# EAGLE design PCB_Acquisition_board.v1.4.3 (EAGLE 9.6.2)
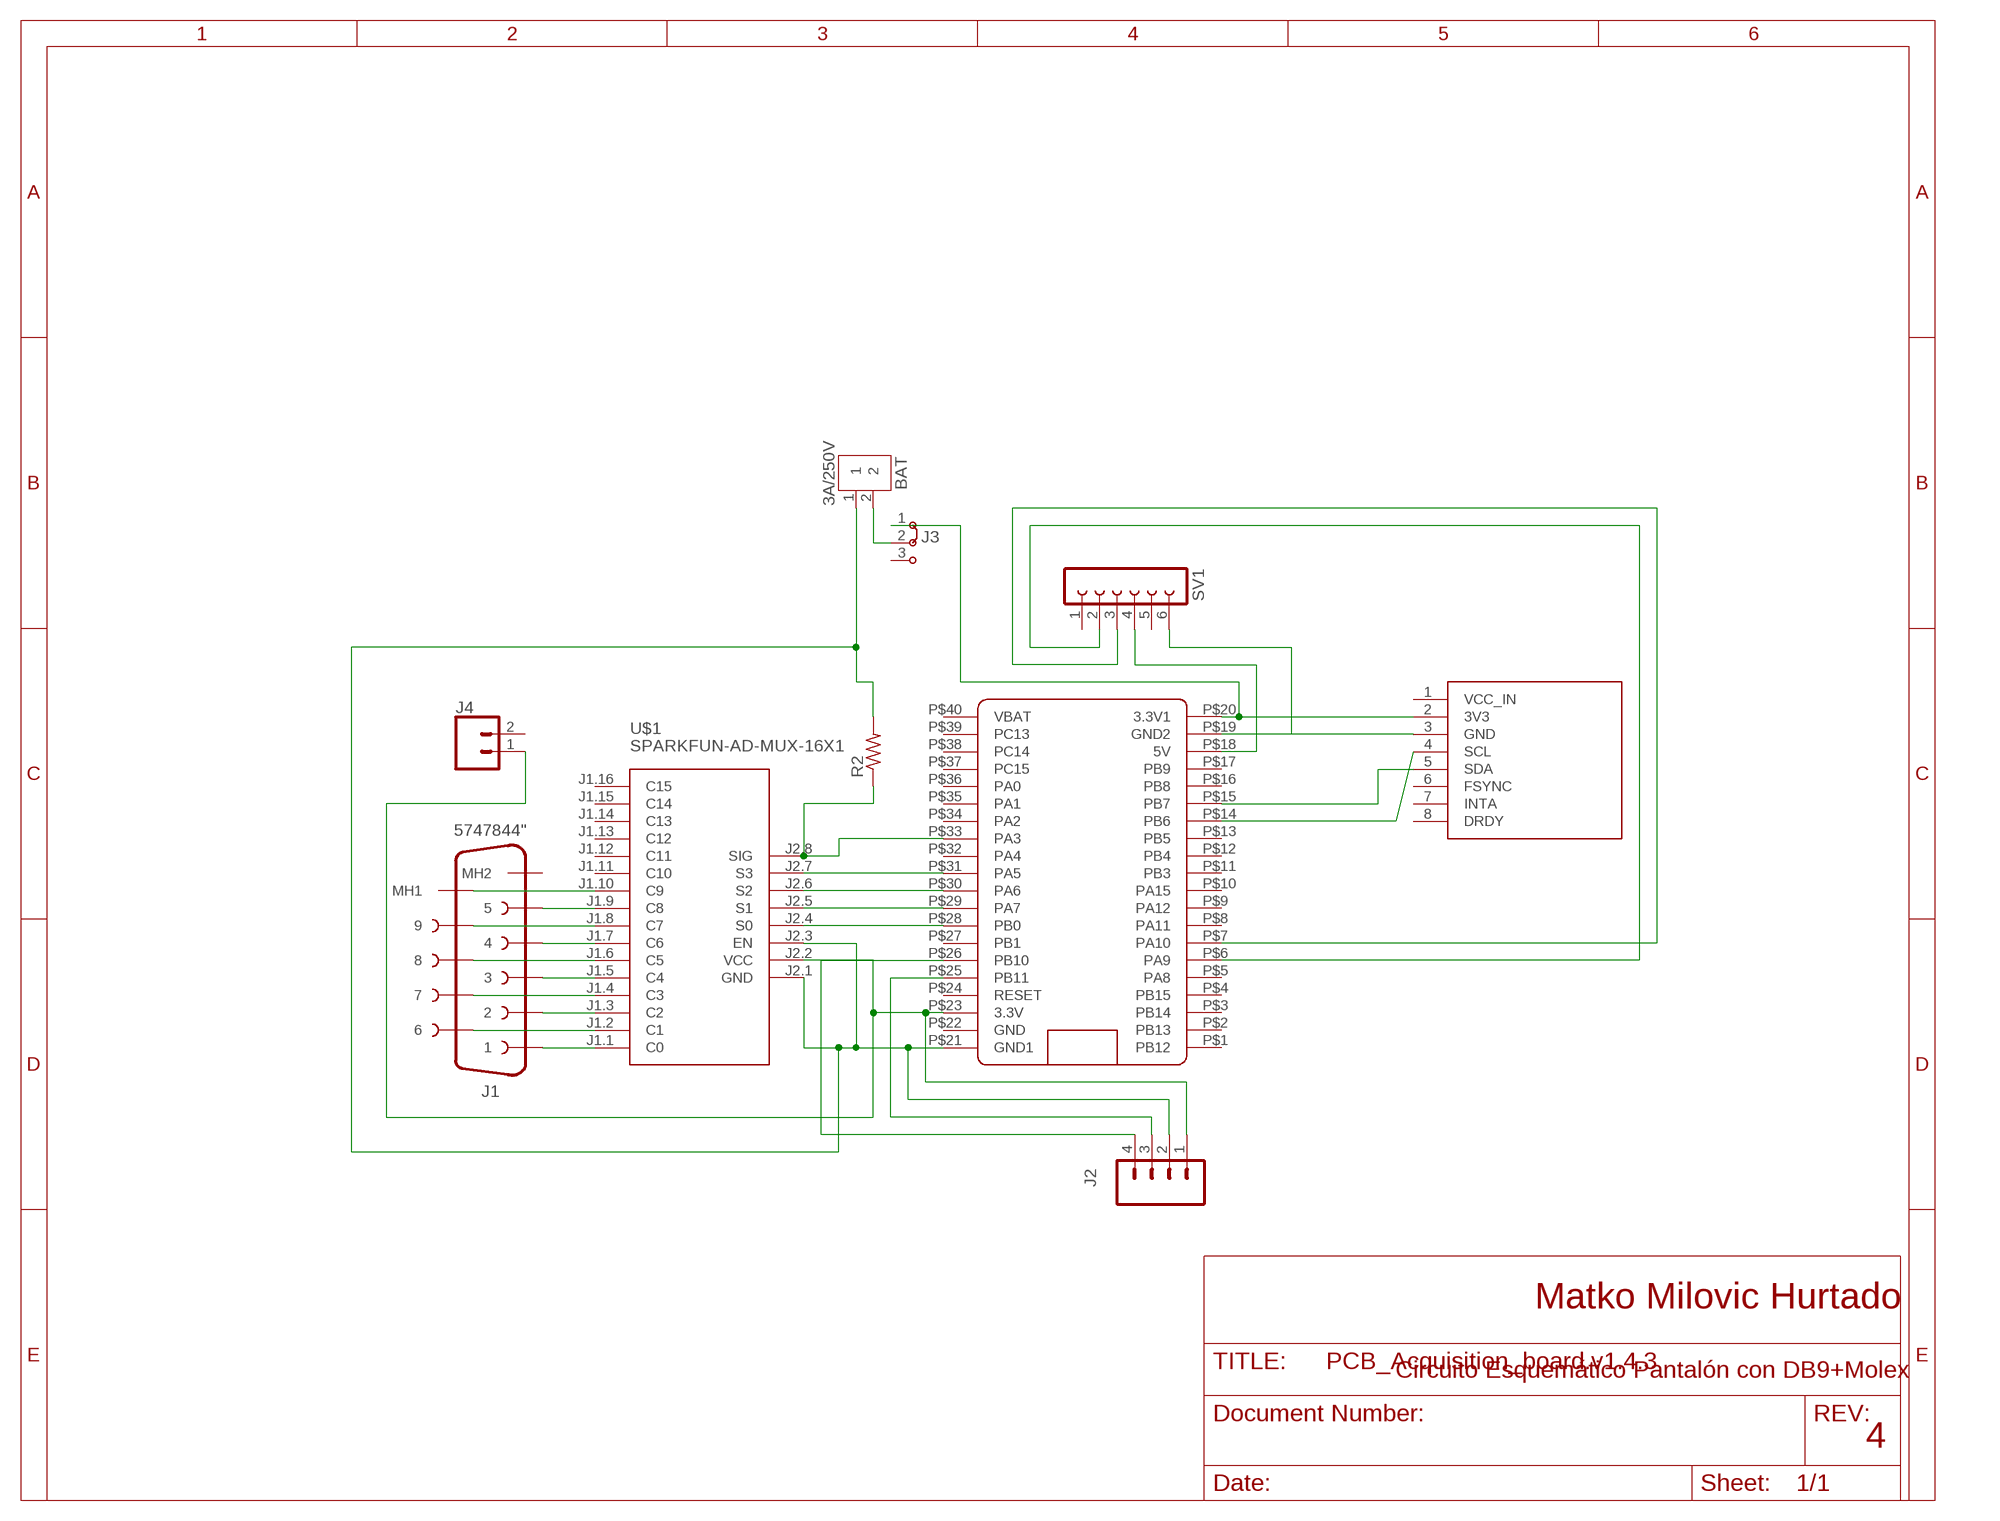
[diagram p0: schematic, sheet 1]

## Parts
BAT  3A/250V  B2B-XH-A  [B2B-XH-A]
J1  5747844"  [5747844-4]
J2  CONN_04  [1X04]
J3  J2X2MM  [04C]
J4  CONN_02  [1X02]
R2  R-US_0309/10  [0309/10]
SV1  FE06-1  [FE06]
U$1  SPARKFUN-AD-MUX-16X1  [SPARKFUN-AD-MUX-16X1]
U$2  GY-86  [GY-86]
U$5  BLUE_PILL  [BLUE_PILL]

## Nets
MH1: J1.MH2(MH1) U$1.J1.10(C9)
N$1: BAT.2 J3.2
N$2: U$2.4(SCL) U$5.P$14(PB6)
N$3: J1.1 U$1.J1.1(C0)
N$4: J1.6 U$1.J1.2(C1)
N$5: J1.2 U$1.J1.3(C2)
N$6: J1.7 U$1.J1.4(C3)
N$7: J1.3 U$1.J1.5(C4)
N$8: J1.8 U$1.J1.6(C5)
N$10: J1.4 U$1.J1.7(C6)
N$11: J1.9 U$1.J1.8(C7)
N$13: J2.3 U$5.P$25(PB11)
N$14: U$1.J2.4(S0) U$5.P$28(PB0)
N$15: J1.5 U$1.J1.9(C8)
N$16: J2.1 J4.1 U$1.J2.2(VCC) U$5.P$23(3.3V)
N$17: BAT.1 J2.2 R2.2 U$1.J2.1(GND) U$1.J2.3(EN) U$5.P$21(GND1)
N$18: J2.4 U$5.P$26(PB10)
N$19: U$2.5(SDA) U$5.P$15(PB7)
N$20: SV1.3 U$5.P$7(PA10)
N$21: SV1.2 U$5.P$6(PA9)
N$25: U$1.J2.5(S1) U$5.P$29(PA7)
N$26: U$1.J2.6(S2) U$5.P$30(PA6)
N$27: U$1.J2.7(S3) U$5.P$31(PA5)
N$28: R2.1 U$1.J2.8(SIG) U$5.P$33(PA3)
N$30: SV1.6 U$2.3(GND) U$5.P$19(GND2)
N$31: J3.1 U$2.2(3V3) U$5.P$20(3.3V1)
N$35: SV1.4 U$5.P$18(5V)
Unconnected: J1.MH1(MH2) J3.3 J4.2 SV1.1 SV1.5 U$1.J1.11(C10) U$1.J1.12(C11) U$1.J1.13(C12) U$1.J1.14(C13) U$1.J1.15(C14) U$1.J1.16(C15) U$2.1(VCC_IN) U$2.6(FSYNC) U$2.7(INTA) U$2.8(DRDY) U$5.P$1(PB12) U$5.P$2(PB13) U$5.P$3(PB14) U$5.P$4(PB15) U$5.P$5(PA8) U$5.P$8(PA11) U$5.P$9(PA12) U$5.P$10(PA15) U$5.P$11(PB3) U$5.P$12(PB4) U$5.P$13(PB5) U$5.P$16(PB8) U$5.P$17(PB9) U$5.P$22(GND) U$5.P$24(RESET) U$5.P$27(PB1) U$5.P$32(PA4) U$5.P$34(PA2) U$5.P$35(PA1) U$5.P$36(PA0) U$5.P$37(PC15) U$5.P$38(PC14) U$5.P$39(PC13) U$5.P$40(VBAT)

## Notes on the sheet
- Matko Milovic Hurtado
- Circuito Esquemático Pantalón con DB9+Molex
- 4

## Library data of the parts
BAT = Connector:B2B-XH-A: XH Connector Top Entry - 2POS Details see: Datasheet <http://www.jst-mfg.com/product/pdf/eng/eXH.pdf>; CATEGORY: CONNECTOR; DESCRIPTION: 2.5mm pitch/disconnectable crimp style connector; MANUFACTURER: JST (XH CONNECTOR); MPN: B2B-XH-A; OPERATING_TEMPERATURE: -25°C ~ 85°C; PART_STATUS: ACTIVE; ROHS_COMPLIANT: COMPLIANT; SERIES: B_B-XH-A; SUB_CATEGORY: Through hole connector; TYPE: top entry
J1 = Connector_D-Sub:5747844: D-SUB, 9POS, RCPT, R/A SLDR Datasheet <https://www.te.com/commerce/DocumentDelivery/DDEController?Action=showdoc&DocId=Catalog+Section%7F82068_AMPLIMITE_Right-Angle_Posted_Conn%7F0412%7Fpdf%7FEnglish%7FENG_CS_82068_AMPLIMITE_Right-Angle_Posted_Conn_0412.pdf%7F5747840-4>; CATEGORY: Connector; DESCRIPTION: PCB D-Sub Connectors, Receptacle, Board-to-Board, 9 Position, 2.74mm [.108in] Centerline, 2 Row, Row-to-Row Spacing 2.84 mm [. 112 in]; GENDER: Female; MANUFACTURER: TE Connectivity; MPN: 5747844-4; OPERATING_TEMP: -55°C to +105 °C; PART_STATUS: Active; ROHS_COMPLIANT: RoHS Compliant; SERIES: AMPLIMITE HD-20; SUB-CATEGORY: D-SUB; TYPE: R/A
J2 = SparkFun-Connectors:CONN_04: Multi connection point. Often used as Generic Header-pin footprint for 0.1 inch spaced/style header connections On any of the 0.1 inch spaced packages, you can populate with these: Break Away Headers - Straight <https://www.sparkfun.com/products/116> (PRT-00116) Break Away Male Headers - Right Angle <https://www.sparkfun.com/products/553> (PRT-00553) Female Headers <https://www.sparkfun.com/products/115> (PRT-00115) Break Away Headers - Machine Pin <https://www.sparkfun.com/products/117> (PRT-00117) Break Away Female Headers - Swiss Machine Pin <https://www.sparkfun.com/products/743> (PRT-00743) For SCREWTERMINALS and SPRING TERMINALS visit here: Screw Terimnals on SparkFun.com <https://www.sparkfun.com/search/results?term=Screw+Terminals> (5mm/3.5mm/2.54mm spacing) This device is also useful as a general connection point to wire up your design to another part of your project. Our various solder wires solder well into these plated through hole pads. Hook-Up Wire - Assortment (Stranded, 22 AWG) <https://www.sparkfun.com/products/11375> (PRT-11375) Hook-Up Wire - Assortment (Solid Core, 22 AWG) <https://www.sparkfun.com/products/11367> (PRT-11367) View the entire wire category on our website here <https://www.sparkfun.com/categories/141> Special notes: Molex polarized connector foot print use with SKU : PRT-08231 with associated crimp pins and housings. 1MM SMD Version SKU: PRT-10208; PROD_ID: CONN-09696
J3 = jumper:J2: Jumper switch 2 x 2.5 mm
J4 = SparkFun-Connectors:CONN_02: Multi connection point. Often used as Generic Header-pin footprint for 0.1 inch spaced/style header connections On any of the 0.1 inch spaced packages, you can populate with these: Break Away Headers - Straight <https://www.sparkfun.com/products/116> (PRT-00116) Break Away Male Headers - Right Angle <https://www.sparkfun.com/products/553> (PRT-00553) Female Headers <https://www.sparkfun.com/products/115> (PRT-00115) Break Away Headers - Machine Pin <https://www.sparkfun.com/products/117> (PRT-00117) Break Away Female Headers - Swiss Machine Pin <https://www.sparkfun.com/products/743> (PRT-00743) For SCREWTERMINALS and SPRING TERMINALS visit here: Screw Terimnals on SparkFun.com <https://www.sparkfun.com/search/results?term=Screw+Terminals> (5mm/3.5mm/2.54mm spacing) This device is also useful as a general connection point to wire up your design to another part of your project. Our various solder wires solder well into these plated through hole pads. Hook-Up Wire - Assortment (Stranded, 22 AWG) <https://www.sparkfun.com/products/11375> (PRT-11375) Hook-Up Wire - Assortment (Solid Core, 22 AWG) <https://www.sparkfun.com/products/11367> (PRT-11367) View the entire wire category on our website here <https://www.sparkfun.com/categories/141> Special notes: Molex polarized connector foot print use with: PRT-08233 with associated crimp pins and housings. 2.54_SCREWTERM for use with PRT-10571. 3.5mm Screw Terminal footprints for PRT-08084 5mm Screw Terminal footprints for use with PRT-08432
R2 = rcl:R-US_: RESISTOR, American symbol; SPICEPREFIX: R
SV1 = con-lsta:FE06-1: FEMALE HEADER; OC_FARNELL: unknown; OC_NEWARK: unknown
U$1 = diy-modules:SPARKFUN-AD-MUX-16X1: SparkFun Analog/Digital MUX Breakout based on CD74HC4067 chip Source: https://www.sparkfun.com/products/9056
U$2 = GY_Boards:GY-86
U$5 = BluePill:BLUE_PILL

## Module MUX16CH
Ports: 

### Library data of the parts

## Board
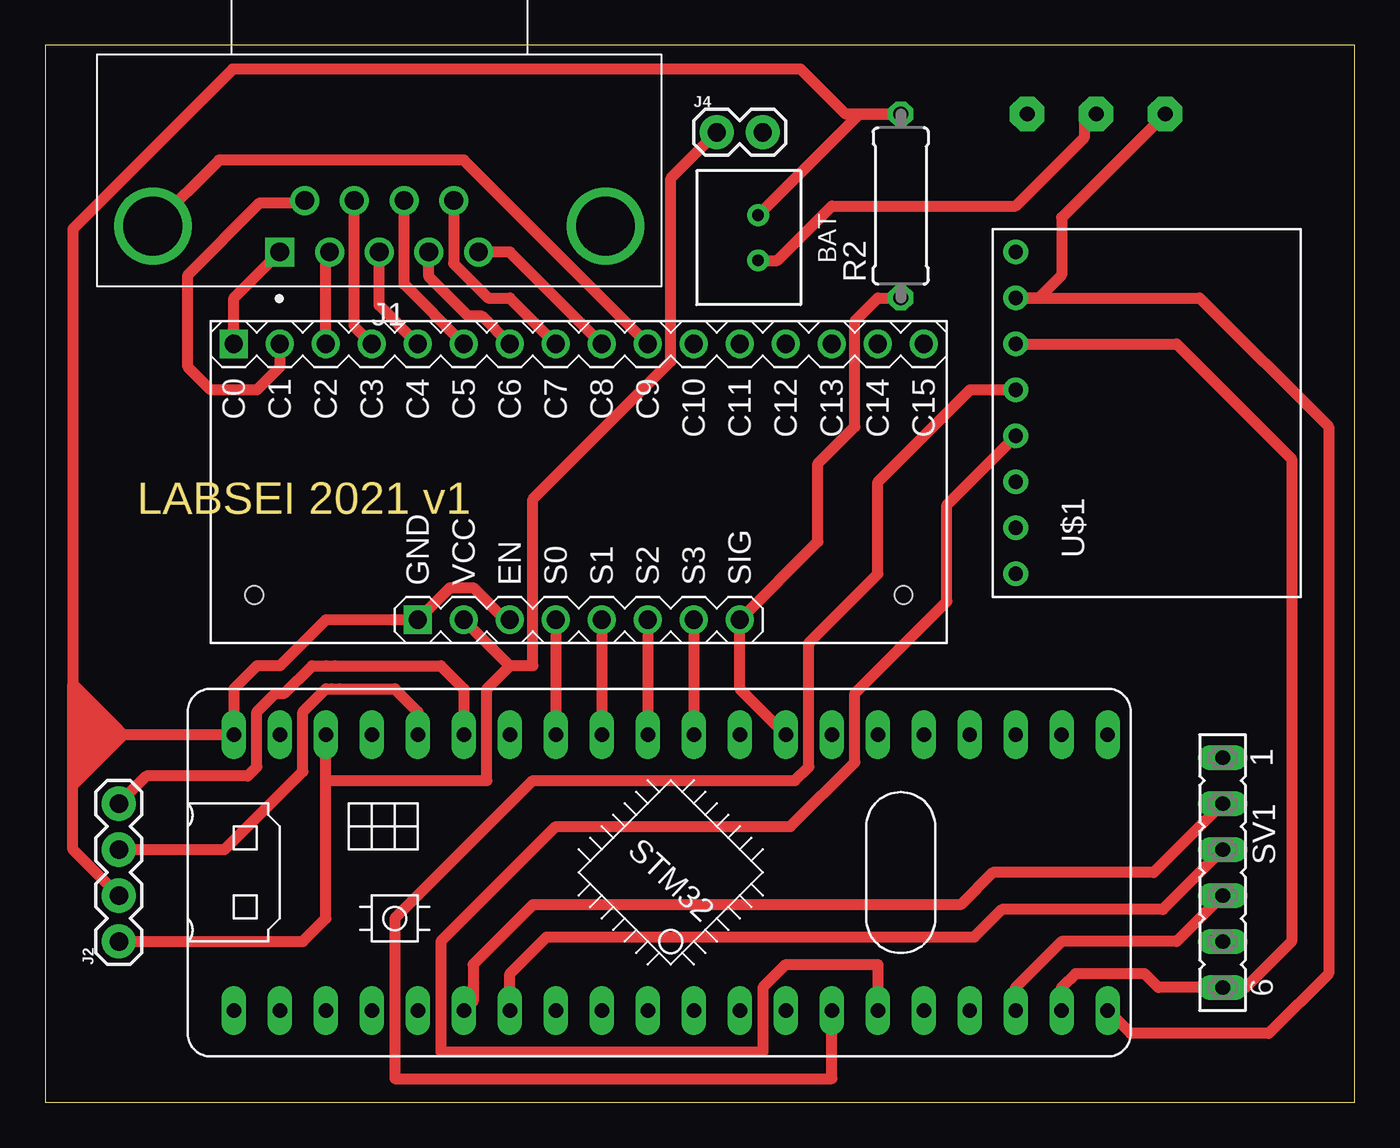
[diagram p1: board, top side]
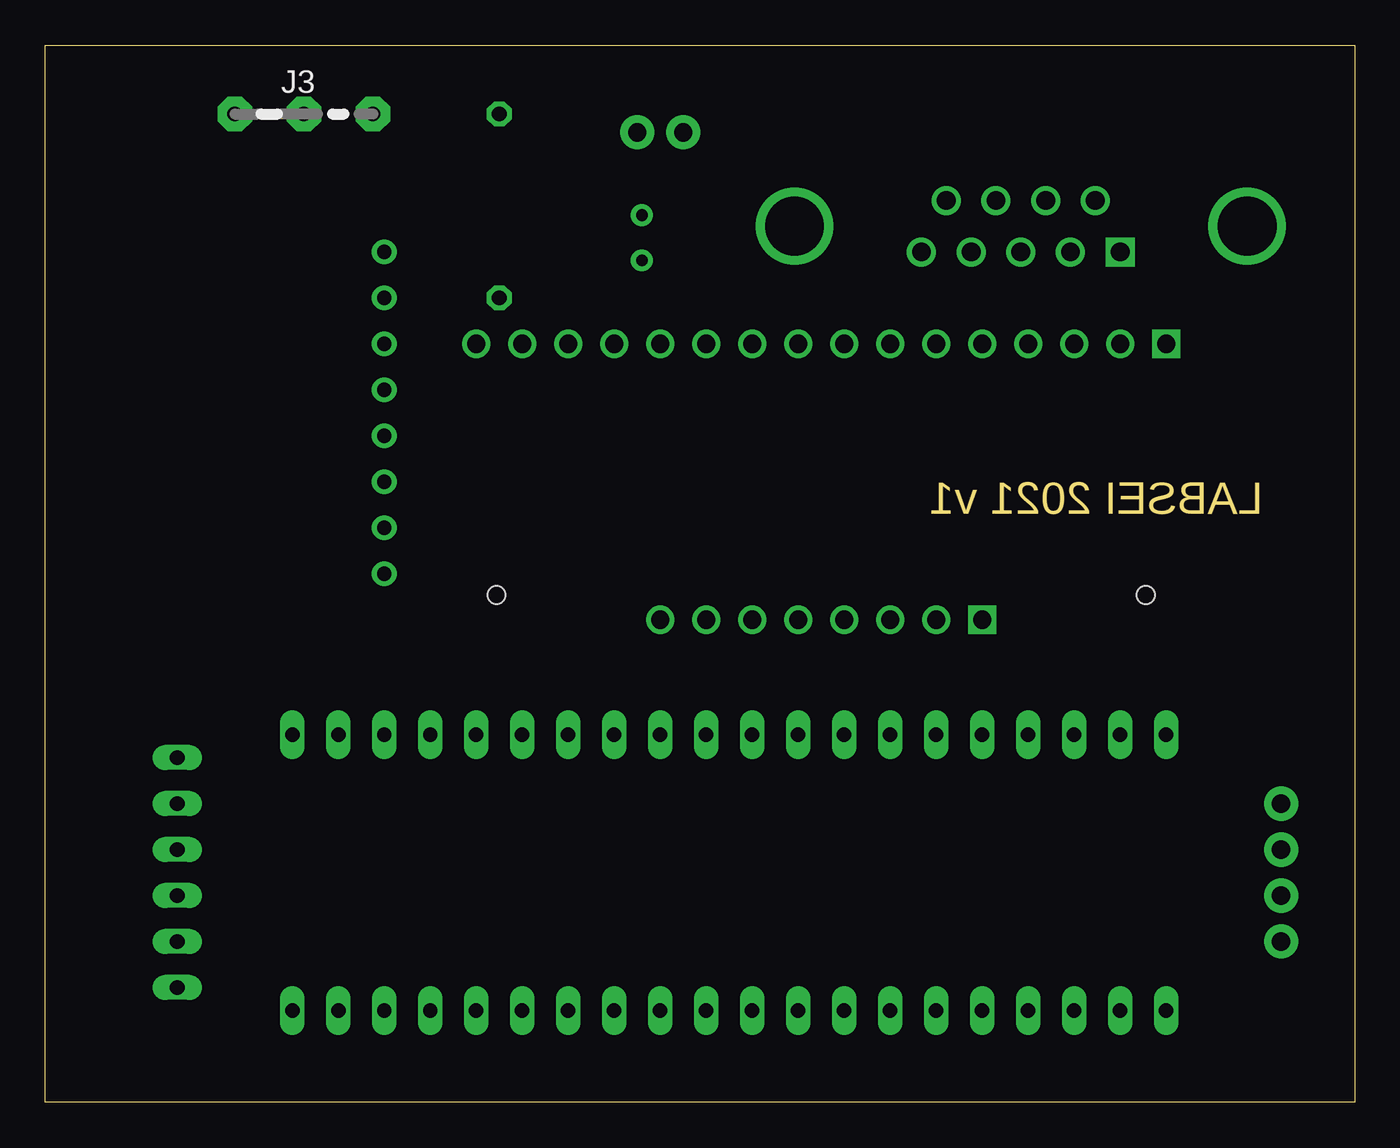
[diagram p2: board, bottom side, seen from below]

Size 72.31 x 58.41 mm. Coordinates in mm from the lower left corner, seen from the top.
Outline: 0,0 72.31,0 72.31,58.41 0,58.41 0,0
Copper layers (1*16): Top 0.035mm / dielectric 1.5mm / Bottom 0.035mm
Design rules "default *": minimum track width 6mil, minimum drill 0.35mm, track to track 6mil, track to pad 6mil, pad to pad 6mil, via to via 6mil, smd to smd 6mil, copper to edge 40mil, drill to drill 6mil, minimum pad ring 11mil, minimum via ring 10mil, stop-mask expansion 4mil, vias tented up to drill 0mil, thermal gap 10mil

### Footprints (pad centres in the part's own frame; a part is rotated, then mirrored left to right if it is on the bottom)
B2B-XH-A = drill 0.64: 1 0,0; 2 2.5,0
5747844-4 = drill 1.041 square: 1 0,0 | drill 1.041: 2 -2.743,0; 3 -5.486,0; 4 -8.23,0; 5 -10.973,0; 6 -1.372,-2.845; 7 -4.115,-2.845; 8 -6.858,-2.845; 9 -9.601,-2.845 | drill 3.251: MH1 -17.983,-1.422; MH2 7.01,-1.422
1X04 = drill 1.016 pad 1.88: 1 0,0; 2 2.54,0; 3 5.08,0; 4 7.62,0
04C = drill 0.813 pad 1.905 octagon: 1 -1.905,0; 2 1.905,0; 3 5.715,0
1X02 = drill 1.016 pad 1.88: 1 0,0; 2 2.54,0
0309/10 = drill 0.813 octagon: 1 -5.08,0; 2 5.08,0
FE06 = drill 0.813 long: 1 -6.35,0; 2 -3.81,0; 3 -1.27,0; 4 1.27,0; 5 3.81,0; 6 6.35,0
SPARKFUN-AD-MUX-16X1 = drill 1 square: J1.1 -7.62,-19.05; J2.1 7.62,-8.89 | drill 1: J1.2 -7.62,-16.51; J1.3 -7.62,-13.97; J1.4 -7.62,-11.43; J1.5 -7.62,-8.89; J1.6 -7.62,-6.35; J1.7 -7.62,-3.81; J1.8 -7.62,-1.27; J1.9 -7.62,1.27; J1.10 -7.62,3.81; J1.11 -7.62,6.35; J1.12 -7.62,8.89; J1.13 -7.62,11.43; J1.14 -7.62,13.97; J1.15 -7.62,16.51; J1.16 -7.62,19.05; J2.2 7.62,-6.35; J2.3 7.62,-3.81; J2.4 7.62,-1.27; J2.5 7.62,1.27; J2.6 7.62,3.81; J2.7 7.62,6.35; J2.8 7.62,8.89 | hole 1: 6.245,-17.93; 6.245,17.93
GY-86 = drill 0.8: 1 1.27,19.05; 2 1.27,16.51; 3 1.27,13.97; 4 1.27,11.43; 5 1.27,8.89; 6 1.27,6.35; 7 1.27,3.81; 8 1.27,1.27
BLUE_PILL = drill 0.8 long: P$1 -7.62,15.24; P$2 -7.62,12.7; P$3 -7.62,10.16; P$4 -7.62,7.62; P$5 -7.62,5.08; P$6 -7.62,2.54; P$7 -7.62,0; P$8 -7.62,-2.54; P$9 -7.62,-5.08; P$10 -7.62,-7.62; P$11 -7.62,-10.16; P$12 -7.62,-12.7; P$13 -7.62,-15.24; P$14 -7.62,-17.78; P$15 -7.62,-20.32; P$16 -7.62,-22.86; P$17 -7.62,-25.4; P$18 -7.62,-27.94; P$19 -7.62,-30.48; P$20 -7.62,-33.02; P$21 7.62,15.24; P$22 7.62,12.7; P$23 7.62,10.16; P$24 7.62,7.62; P$25 7.62,5.08; P$26 7.62,2.54; P$27 7.62,0; P$28 7.62,-2.54; P$29 7.62,-5.08; P$30 7.62,-7.62; P$31 7.62,-10.16; P$32 7.62,-12.7; P$33 7.62,-15.24; P$34 7.62,-17.78; P$35 7.62,-20.32; P$36 7.62,-22.86; P$37 7.62,-25.4; P$38 7.62,-27.94; P$39 7.62,-30.48; P$40 7.62,-33.02

### Placement (x,y rotation side)
BAT  39.37,49.02 270 top
J1  12.95,46.99 180 top
J2  4.06,8.89 90 top
J3  59.94,54.61 0 bottom
J4  37.08,53.59 0 top
R2  47.24,49.53 90 top
SV1  65.02,12.7 270 top
U$1  29.46,34.29 270 top
U$2  52.32,27.94 0 top
U$5  25.65,12.7 90 top

### Tracks (layer width: path | path; a pad name or v marks a point on that pad's centre or on a via)
MH1
  Top 0.61: U$1.J1.10 23.11,52.07 9.6,52.07 J1.MH2
N$1
  Top 0.61: BAT.2 40.43,46.52 43.43,49.53 53.59,49.53 57.4,53.34 57.4,54.61 J3.2
N$2
  Top 0.61: U$2.4 51.05,39.37 45.97,34.29 45.97,29.2 42.16,25.39 42.16,18.54 41.4,17.78 26.92,17.78 19.3,10.16 19.3,1.32 43.43,1.32 U$5.P$14
N$3
  Top 0.61: U$1.J1.1 10.41,44.45 J1.1
N$4
  Top 0.61: J1.6 14.19,49.7 11.86,49.7 7.87,45.72 7.87,40.64 9.14,39.37 11.68,39.37 12.95,40.64 U$1.J1.2
N$5
  Top 0.61: U$1.J1.3 15.49,46.79 J1.2
N$6
  Top 0.61: 17.2,49.7 J1.7 17.07,42.88 U$1.J1.4
N$7
  Top 0.61: U$1.J1.5 18.44,44.04 J1.3
N$8
  Top 0.61: U$1.J1.6 19.81,45.21 J1.8
N$9  (via drill 0.35)
  other vias: 5.84,48.51
N$10
  Top 0.61: J1.4 21.18,45.62 23.37,43.43 24.13,43.43 U$1.J1.7
N$11
  Top 0.61: J1.9 22.55,46.36 24.46,44.45 25.65,44.45 U$1.J1.8
N$12  (via drill 0.35)
  other vias: 30.99,48.51
N$13
  Top 0.61: U$5.P$25 20.57,21.59 19.3,22.86 16.26,22.86 15.81,22.86 15.49,22.86 14.22,21.59 14.22,18.29 9.91,13.97 J2.3
N$14
  Top 0.61: U$1.J2.4 U$5.P$28
N$15
  Top 0.61: U$1.J1.9 25.65,46.99 J1.5
N$16
  Top 0.61: J2.1 14.22,8.89 15.49,10.16 15.49,17.78 | 15.49,17.78 U$5.P$23 | 25.65,24.13 26.92,24.13 26.92,33.34 34.54,40.96 34.54,51.05 J4.1 | 25.65,24.13 U$1.J2.2 | 15.49,17.78 24.38,17.78 24.38,22.86 25.65,24.13
N$17
  Top 0.508: 2.03,22.1 2.54,22.1
  Top 0.61: BAT.1 44.96,54.61 R2.2 44.2,54.61 41.72,57.09 10.35,57.09 1.52,48.26 1.52,23.11 | 4.32,20.32 U$5.P$21 10.41,22.86 11.68,24.13 12.95,24.13 15.49,26.67 U$1.J2.1 22.35,28.45 23.62,28.45 25.4,26.67 U$1.J2.3 | 1.52,23.11 2.03,22.61 | 2.03,22.61 2.54,22.1 | 4.32,20.32 3.81,20.83 | 3.81,20.83 3.43,21.21 | 3.43,21.21 3.17,21.46 2.92,21.72 | J2.2 1.52,13.97 1.52,17.53 | 1.52,17.53 1.52,18.29 | 1.52,18.29 1.52,23.11 | 4.32,20.32 1.52,17.53 | 2.03,22.61 2.03,22.1 2.03,21.59 | 1.52,18.29 2.03,18.8 2.03,19.05 | 2.54,22.1 2.03,21.59 | 2.03,21.59 2.03,19.05 | 2.92,21.72 2.92,20.32 | 2.92,20.32 2.92,19.69 | 2.92,19.69 2.79,19.56 | 2.79,19.56 2.54,19.81 2.54,22.1 | 2.79,19.56 2.29,19.05 2.03,19.05 | 3.43,21.21 3.43,20.83 2.92,20.32 | 2.92,19.69 3.81,20.57 3.81,20.83 | 2.54,22.1 2.92,21.72
N$18
  Top 0.61: J2.4 5.59,18.03 11.18,18.03 11.68,18.54 11.68,21.59 12.7,22.61 13.21,22.61 14.73,24.13 15.49,24.13 16,24.13 21.84,24.13 23.11,22.86 U$5.P$26
N$19
  Top 0.61: U$2.5 49.78,33.02 49.78,27.69 44.7,22.61 44.7,18.8 41.15,15.24 28.19,15.24 21.84,8.89 21.84,2.79 39.62,2.79 39.62,6.35 40.89,7.62 45.97,7.62 U$5.P$15
N$20
  Top 0.61: SV1.3 61.72,10.67 52.83,10.67 51.31,9.14 27.69,9.14 25.65,7.11 U$5.P$7
N$21
  Top 0.61: SV1.2 61.21,12.7 52.32,12.7 50.55,10.92 26.92,10.92 23.62,7.62 23.62,5.59 U$5.P$6
N$25
  Top 0.61: U$1.J2.5 U$5.P$29
N$26
  Top 0.61: U$1.J2.6 U$5.P$30
N$27
  Top 0.61: U$1.J2.7 U$5.P$31
N$28
  Top 0.61: U$5.P$33 38.35,22.86 U$1.J2.8 42.67,30.99 42.67,35.31 44.7,37.34 44.7,43.18 45.97,44.45 R2.1
N$30
  Top 0.61: U$5.P$19 56.13,6.35 56.9,7.11 60.71,7.11 61.47,6.35 SV1.6 66.29,6.35 68.83,8.89 68.83,35.56 62.48,41.91 U$2.3
N$31
  Top 0.61: J3.1 56.13,48.89 56.13,45.72 54.86,44.45 U$2.2 63.75,44.45 70.87,37.34 70.87,7.11 67.56,3.81 59.94,3.81 U$5.P$20
N$35
  Top 0.61: SV1.4 62.48,8.89 56.13,8.89 53.59,6.35 U$5.P$18

### Text on the board
Dimension: LABSEI 2021 v1
Edge: LABSEI 2021 v1